# Altium project MotorDrive_1.PrjPcb
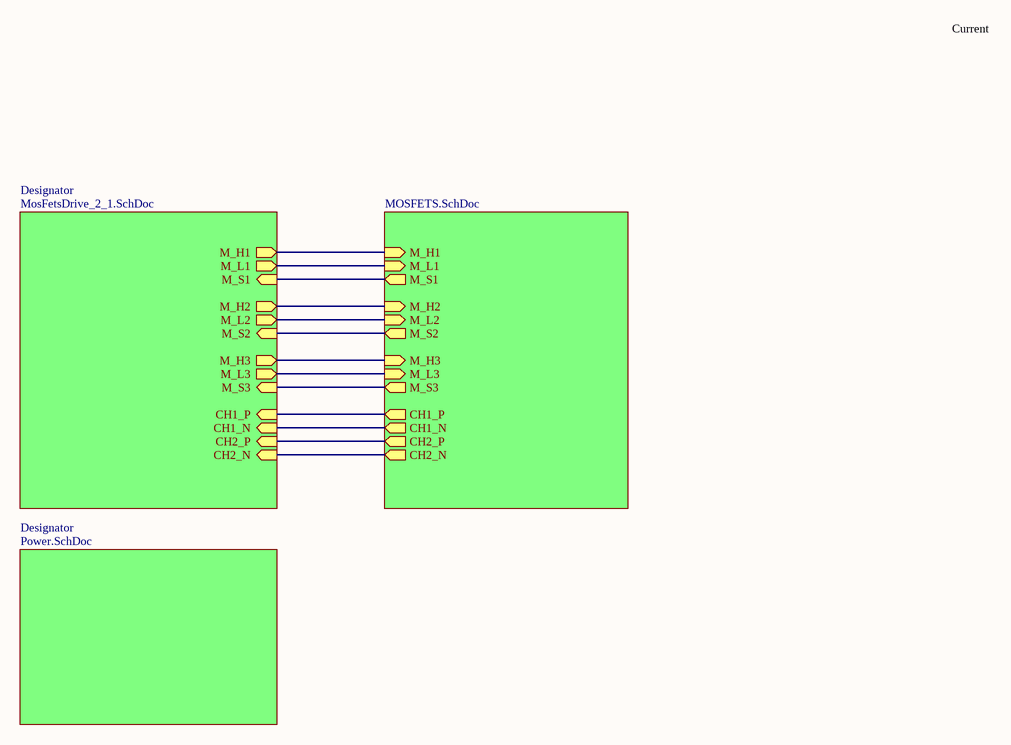
[diagram p0: MotorDriveBoard.SchDoc]
4 sheets, 68 parts. Net scope: hierarchical (ports join the sheet entries above them; power ports are global).
Board file: MotorDrive.PcbDoc
Sheets:
  MotorDriveBoard.SchDoc
     = MOSFETS.SchDoc
    Designator = MosFetsDrive_2_1.SchDoc
    Designator = Power.SchDoc

## Sheet MotorDriveBoard.SchDoc
size A4; SheetNumber: 2; SheetTotal: 7

### Sub-sheets
Designator = MosFetsDrive_2_1.SchDoc: M_H1 (out), M_L1 (out), M_H2 (out), M_L2 (out), M_H3 (out), M_L3 (out), M_S1 (in), M_S2 (in), M_S3 (in), CH1_P (in), CH1_N (in), CH2_P (in), CH2_N (in)
Designator = Power.SchDoc: no entries
? = MOSFETS.SchDoc: M_H1 (in), M_L1 (in), M_H2 (in), M_L2 (in), M_H3 (in), M_L3 (in), M_S1 (out), M_S2 (out), M_S3 (out), CH1_P (out), CH1_N (out), CH2_P (out), CH2_N (out)

### Nets
SH1_N: sheet /CH1_N, sheet Designator/CH1_N
SH1_P: sheet /CH1_P, sheet Designator/CH1_P
SH2_N: sheet /CH2_N, sheet Designator/CH2_N
SH2_P: sheet /CH2_P, sheet Designator/CH2_P
U: sheet /M_S1, sheet Designator/M_S1
V: sheet /M_S2, sheet Designator/M_S2
W: sheet /M_S3, sheet Designator/M_S3
NetR501_1: sheet /M_H1, sheet Designator/M_H1
NetR502_1: sheet /M_L1, sheet Designator/M_L1
NetR503_1: sheet /M_H2, sheet Designator/M_H2
NetR504_1: sheet /M_L2, sheet Designator/M_L2
NetR505_1: sheet /M_H3, sheet Designator/M_H3
NetR506_1: sheet /M_L3, sheet Designator/M_L3

### Notes on the sheet
- Current

## Sheet MOSFETS.SchDoc
size A4; SheetNumber: 3; SheetTotal: 7
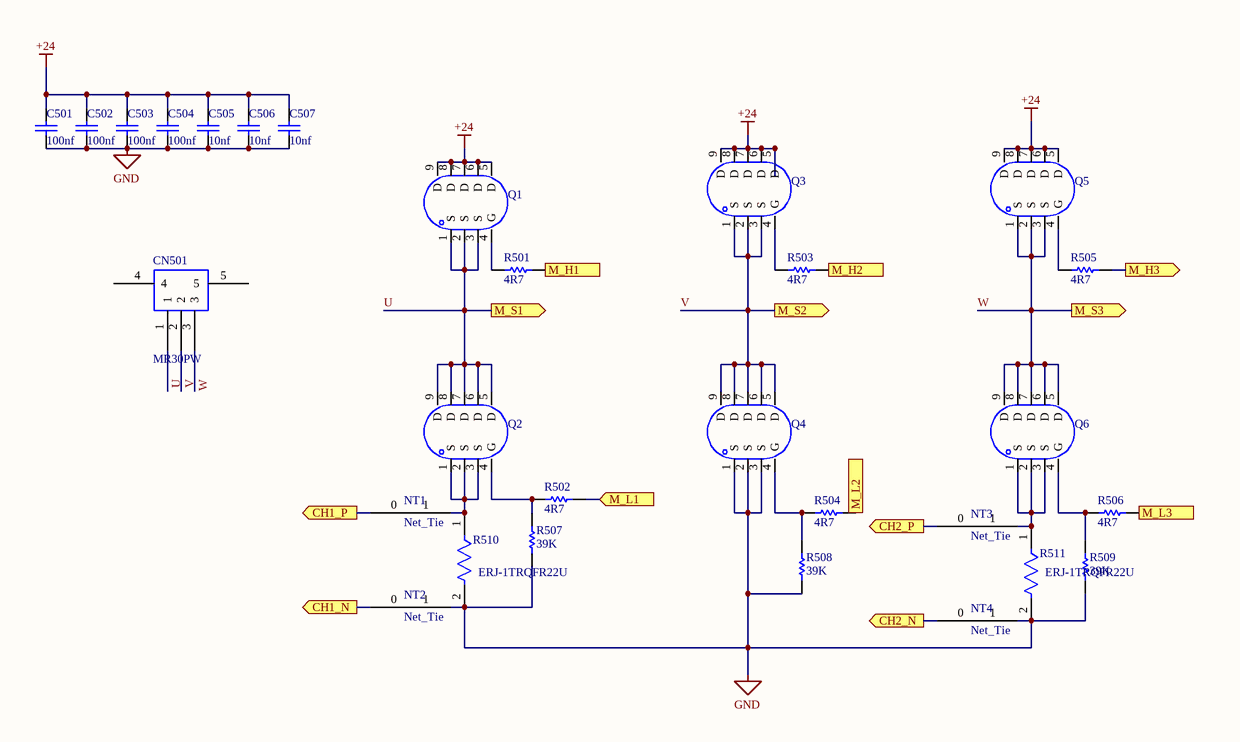
[diagram p1: MOSFETS.SchDoc]

### Parts
C501  100nf  [AVX-1206-2_L]
C502  100nf  [AVX-1206-2_L]
C503  100nf  [AVX-1206-2_L]
C504  100nf  [AVX-1206-2_L]
C505  10nf  [AVX-1206-2_L]
C506  10nf  [AVX-1206-2_L]
C507  10nf  [AVX-1206-2_L]
CN501  MR30PW  [MR30]
NT1  Net_Tie  [NT]  (net tie, no BOM)
NT2  Net_Tie  [NT]  (net tie, no BOM)
NT3  Net_Tie  [NT]  (net tie, no BOM)
NT4  Net_Tie  [NT]  (net tie, no BOM)
Q1  TPH1R403NL  [DSOP-8_L5.0-W5.0-P1.27-EP-TL]  (value not drawn)
Q2  TPH1R403NL  [DSOP-8_L5.0-W5.0-P1.27-EP-TL]  (value not drawn)
Q3  TPH1R403NL  [DSOP-8_L5.0-W5.0-P1.27-EP-TL]  (value not drawn)
Q4  TPH1R403NL  [DSOP-8_L5.0-W5.0-P1.27-EP-TL]  (value not drawn)
Q5  TPH1R403NL  [DSOP-8_L5.0-W5.0-P1.27-EP-TL]  (value not drawn)
Q6  TPH1R403NL  [DSOP-8_L5.0-W5.0-P1.27-EP-TL]  (value not drawn)
R501  4R7  [RESC1608X55X25ML10T15]
R502  4R7  [RESC1608X55X25ML10T15]
R503  4R7  [RESC1608X55X25ML10T15]
R504  4R7  [RESC1608X55X25ML10T15]
R505  4R7  [RESC1608X55X25ML10T15]
R506  4R7  [RESC1608X55X25ML10T15]
R507  39K  [RESC1608X55X25ML10T15]
R508  39K  [RESC1608X55X25ML10T15]
R509  39K  [RESC1608X55X25ML10T15]
R510  ERJ-1TRQFR22U  [FP-ERJ1TR-MFG]
R511  ERJ-1TRQFR22U  [FP-ERJ1TR-MFG]

### Ports
CH1_N (out), CH1_P (out), CH2_N (out), CH2_P (out), M_H1 (out), M_H2 (out), M_H3 (out), M_L1 (in), M_L2 (in), M_L3 (in), M_S1 (out), M_S2 (out), M_S3 (out)

### Nets
+24: C501.2 C502.2 C503.2 C504.2 C505.2 C506.2 C507.2 Q1.5(D) Q1.6(D) Q1.7(D) Q1.8(D) Q1.9(D) Q3.5(D) Q3.6(D) Q3.7(D) Q3.8(D) Q3.9(D) Q5.5(D) Q5.6(D) Q5.7(D) Q5.8(D) Q5.9(D)
GND: C501.1 C502.1 C503.1 C504.1 C505.1 C506.1 C507.1 NT2.1 NT4.1 Q4.1(S) Q4.2(S) Q4.3(S) R507.1 R508.1 R509.1 R510.2 R511.2
SH1_N: NT2.0 ; port CH1_N
SH1_P: NT1.0 ; port CH1_P
SH2_N: NT4.0 ; port CH2_N
SH2_P: NT3.0 ; port CH2_P
U: CN501.1 Q1.1(S) Q1.2(S) Q1.3(S) Q2.5(D) Q2.6(D) Q2.7(D) Q2.8(D) Q2.9(D) ; port M_S1
V: CN501.2 Q3.1(S) Q3.2(S) Q3.3(S) Q4.5(D) Q4.6(D) Q4.7(D) Q4.8(D) Q4.9(D) ; port M_S2
W: CN501.3 Q5.1(S) Q5.2(S) Q5.3(S) Q6.5(D) Q6.6(D) Q6.7(D) Q6.8(D) Q6.9(D) ; port M_S3
NetNT1_1: NT1.1 Q2.1(S) Q2.2(S) Q2.3(S) R510.1
NetNT3_1: NT3.1 Q6.1(S) Q6.2(S) Q6.3(S) R511.1
NetQ1_4: Q1.4(G) R501.2
NetQ2_4: Q2.4(G) R502.2 R507.2
NetQ3_4: Q3.4(G) R503.2
NetQ4_4: Q4.4(G) R504.2 R508.2
NetQ5_4: Q5.4(G) R505.2
NetQ6_4: Q6.4(G) R506.2 R509.2
NetR501_1: R501.1 ; port M_H1
NetR502_1: R502.1 ; port M_L1
NetR503_1: R503.1 ; port M_H2
NetR504_1: R504.1 ; port M_L2
NetR505_1: R505.1 ; port M_H3
NetR506_1: R506.1 ; port M_L3

Not connected (* = marked no-connect by the designer): CN501 4 5

### Library data of the parts
C501-C507 = CMP-2000-05468-1: Chip Capacitor, 1 nF, +/- 10%, -55 to 125 degC, 1206 (3216 Metric), RoHS, Tape and Reel; PartNumber: 1206GC102KAT1A; Manufacturer: AVX; Capacitance: 0.001uF; Dielectric: X7R; Voltage Rating DC: 2000V; Package Reference: 1206; Datasheet Version: 11/2010; Mounting Technology: SurfaceMount; Manufacturer URL: http://www.avx.com/; Tolerance: 10%; Tolerance (%): ±10%; Datasheet URL: https://datasheet.ciiva.com/11787/0900766b80ed4c37-11787781.pdf; Package Description: 2-Pin SMD, Body 3.4 x 1.8 mm; Case Size/Dimension: 1206; Rated Voltage: 2000V
CN501 = Component_1
Q1-Q6 = TPH1R403NL: Manufacturer: TOSHIBA(东芝); Add into BOM: yes; Type: N沟道; Drain Source Voltage (Vdss): 30V; Continuous Drain Current (Id): 150A; Power Dissipation (Pd): 64W; Drain Source On Resistance (RDS(on)@Vgs,Id): 1.4mΩ@10V,30A; Gate Threshold Voltage (Vgs(th)@Id): 2.3V@500A; Symbol: TPH1R403NL; Device: TPH1R403NL; LCSC Part Name: N沟道 30V 150A; Supplier Part: C83440; Manufacturer Part: TPH1R403NL; Supplier Footprint: SOP Advance; JLCPCB Part Class: Extended Part; Datasheet: https://atta.szlcsc.com/upload/public/pdf/source/20170908/C83440_1504870121708958077.pdf; Supplier: LCSC; Convert to PCB: yes
R501-R509 = CMP-2100-03667-1: Chip Resistor, 0 Ohm, +/- 5%, 0.1 W, -55 to 155 degC, 0603 (1608 Metric), RoHS, Tape and Reel; Manufacturer: Yageo; Temperature Coefficient: 200ppm/degreesC; Voltage Rating: 50V; Power Rating: 100mW; Resistance: 0mOhm; Width: 0.8mm; Max Operating Temperature: 155degC; Tolerance: 5%; Package Reference: 0603; Height: 0.45mm; Depth: 0.8mm; Package Description: 2-Pin Surface Mount Device, Body 1.6 x 0.8 mm; Termination: SMD/SMT; Package Quantity: 5000; Case/Package: 0603; Case Code (Imperial): 0603; Radiation Hardening: No; Number of Pins: 2; Length: 1.6mm; Lead Free: LeadFree; Voltage Rating (DC): 50V; Military Standard: Not; Datasheet URL: http://www.yageo.com/NewPortal/yageodocoutput?fileName=/pdf/R-Chip/PYu-RC_Group_51_RoHS_L_5.pdf; Manufacturer URL: http://www.yageo.com/; Packaging: TapeandReel; Case Code (Metric): 1608; Min Operating Temperature: -55degC; Composition: ThickFilm; RoHSCompliant: true; Contact Plating: Tin; Datasheet Version: Rev. 5, 10/2016; REACH SVHC: NoSVHC
R510 R511 = CMP-05422-000060-1: RES 0.22 OHM 1% 1W 2512; Manufacturer: Panasonic; 3DS Part Number: 110-00006; Value: 0.22Ω; Automotive Grade: Grade 0; Temperature Coefficient: 200ppm/°C; Digikey Description: RES 0.22 OHM 1% 1W 2512; Tolerance: 1%; Temperature Range High: +155°C; Temperature Range Low: -55°C; Series: ERJ; Category: Res; Power Rating: 1W; ComponentLink2URL: https://industrial.panasonic.com/cdbs/www-data/pdf/RDN0000/AOA0000C313.pdf; Device Class L1: Passive Components; Octopart: https://octopart.com/erj1trqfr22u-panasonic-10566390; Device Class L3: Chip SMD Resistors; Temperature: -55°C to +155°C; Composition: Thick Film; Device Class L2: Resistors; Footprint Url: https://industrial.panasonic.com/cdbs/www-data/pdf/RDN0000/DMN0000COL17.pdf; Ipc Land Pattern Name: RESC640320X60; Package: ERJ1TR; Resistance: 0.22Ω; Mouser Description: Current Sense Resistors 2512 0.22ohm 1% Curr Sense AEC-Q200; Manufacturer Part Number: ERJ-1TRQFR22U; RoHS: TRUE; ComponentLink2Description: Datasheet; Lead Free: Yes; Height: 0.7mm; Automotive: Yes

## Sheet MosFetsDrive_2_1.SchDoc
size A4; SheetNumber: 1; SheetTotal: 7
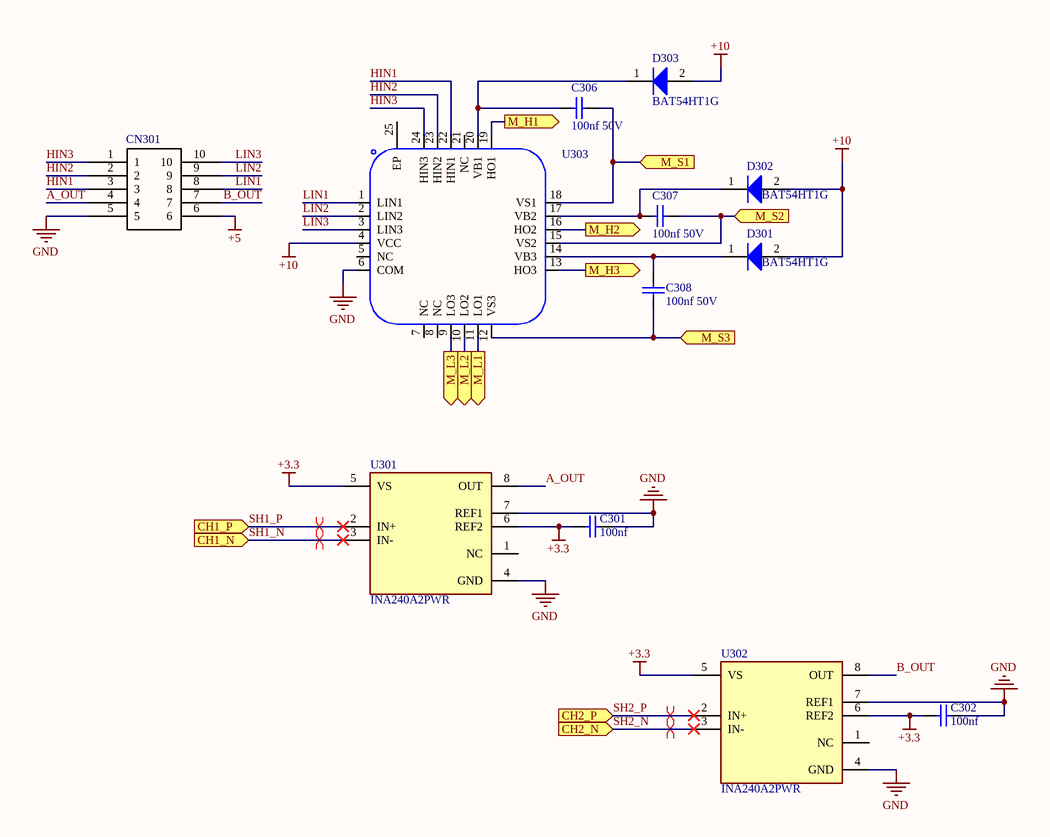
[diagram p2: MosFetsDrive_2_1.SchDoc]

### Parts
C301  100nf  [CAPC1608X90X35ML10T15]
C302  100nf  [CAPC1608X90X35ML10T15]
C306  100nf 50V  [CAPC1005X60X30ML05T10]
C307  100nf 50V  [CAPC1005X60X30ML05T10]
C308  100nf 50V  [CAPC1005X60X30ML05T10]
CN301  (no value)  [2X10Pin]
D301  BAT54HT1G  [ONSC-SOD-323-2-477-02_V]
D302  BAT54HT1G  [ONSC-SOD-323-2-477-02_V]
D303  BAT54HT1G  [ONSC-SOD-323-2-477-02_V]
U301  INA240A2PWR  [FP-PW0008A-MFG]
U302  INA240A2PWR  [FP-PW0008A-MFG]
U303  FD6288Q  [QFN-24_L4.0-W4.0-P0.50-BL-EP2.6]  (value not drawn)

### Ports
CH1_N (in), CH1_P (in), CH2_N (in), CH2_P (in), M_H1 (out), M_H2 (out), M_H3 (out), M_L1 (out), M_L2 (out), M_L3 (out), M_S1 (in), M_S2 (in), M_S3 (in)

### Nets
+3.3: C301.2 C302.2 U301.5(VS) U301.6(REF2) U302.5(VS) U302.6(REF2)
+5: CN301.6
+10: D301.2(A) D302.2(A) D303.2(A) U303.4(VCC)
GND: C301.1 C302.1 CN301.5 U301.4(GND) U301.7(REF1) U302.4(GND) U302.7(REF1) U303.6(COM)
A_OUT: CN301.4 U301.8(OUT)
B_OUT: CN301.7 U302.8(OUT)
HIN1: CN301.3 U303.22(HIN1)
HIN2: CN301.2 U303.23(HIN2)
HIN3: CN301.1 U303.24(HIN3)
LIN1: CN301.8 U303.1(LIN1)
LIN2: CN301.9 U303.2(LIN2)
LIN3: CN301.10 U303.3(LIN3)
SH1_N: U301.3(IN-) ; port CH1_N
SH1_P: U301.2(IN+) ; port CH1_P
SH2_N: U302.3(IN-) ; port CH2_N
SH2_P: U302.2(IN+) ; port CH2_P
U: C306.2 U303.18(VS1) ; port M_S1
V: C307.2 U303.15(VS2) ; port M_S2
W: C308.1 U303.12(VS3) ; port M_S3
NetC306_1: C306.1 D303.1(K) U303.20(VB1)
NetC307_1: C307.1 D302.1(K) U303.17(VB2)
NetC308_2: C308.2 D301.1(K) U303.14(VB3)
NetR501_1: U303.19(HO1) ; port M_H1
NetR502_1: U303.11(LO1) ; port M_L1
NetR503_1: U303.16(HO2) ; port M_H2
NetR504_1: U303.10(LO2) ; port M_L2
NetR505_1: U303.13(HO3) ; port M_H3
NetR506_1: U303.9(LO3) ; port M_L3

Not connected (* = marked no-connect by the designer): U301 1(NC); U302 1(NC); U303 5(NC) 7(NC) 8(NC) 21(NC) 25(EP)

### Layout directives
differential pair: SH1_N, SH1_P, SH2_N, SH2_P

### Library data of the parts
C301 C302 = CMP-2100-03642-1: Chip Capacitor, 10 nF, +/- 10%, 50 V, -55 to 125 degC, 0603 (1608 Metric), RoHS, Tape and Reel; Manufacturer: Murata; Insulation Resistance: 10GR; Dielectric: X7R; Voltage Rating: 50V; Capacitance: 10nF; Material: Ceramic; Package Quantity: 1; Lead Free: LeadFree; Case/Package: 0603; Termination: SMD/SMT; REACH SVHC: Unknown; Manufacturer URL: http://www.murata.com/; Datasheet URL: http://search.murata.co.jp/Ceramy/image/img/A01X/G101/ENG/GRM188R71H103KA01-01.pdf; Mount: SurfaceMount; Datasheet Version: 42401.0; Number of Pins: 2; Length: 1.6mm; Voltage: 50V; Depth: 0.8mm; Tolerance: 10%; Min Operating Temperature: -55degC; Voltage Rating (DC): 50V; Max Operating Temperature: 125degC; Package Description: 2-Pin Surface Mount Device, Body 1.6 x 0.8 mm; RoHSCompliant: True; Case Code (Imperial): 0603; Width: 0.031inch; Case Code (Metric): 1608; Height: 0.8mm; Package Reference: 0603; Packaging: TapeandReel; Thickness: 0.035inch; Dielectric Material: Ceramic
C306-C308 = CMP-2008-02046-1: Manufacturer: Kemet; Part Number: C0402C104K8PACTU
CN301 = Component_1
D301-D303 = CMP-1055-00462-1: Schottky Barrier Diode, 2-Pin SOD-323, Pb-Free, Tape and Reel; Manufacturer: On Semiconductor; Configuration: Single; trr Max (ns): 5; IFSM Max (A): 0.6; ComponentLink3URL: http://www.onsemi.com/pub_link/Collateral/477-02.PDF.1; PackageDescription: 2-Pin SOD, Body 1.7 x 1.25 mm; ComponentLink2URL: http://www.onsemi.cn/pub_link/Collateral/BAT54HT1-D.PDF; ComponentLink3Description: Package Specification; ComponentLink2Description: Datasheet; DatasheetVersion: Rev. 6; PackageReference: SOD-323-2-477-02; RoHS: TRUE; ComponentLink1URL: http://www.onsemi.com/; Packing: Tape and Reel; PartNumber: BAT54HT1G; Mounting Technology: Surface Mount; ComponentLink1Description: Manufacturer URL; PackageVersion: Rev. H, 03/2007
U301 U302 = CMP-04895-000047-1: IC AMP CURRENT SENSE 8-TSSOP; Manufacturer: Texas Instruments; Voltage Gain: 0.05V/mV; Max Supply Voltage: 5.5V; Max Junction Temp: +150°C; Input Offset Voltage: 0.005mV; Bandwidth: 400kHz; Min Supply Voltage: 2.7V; Nominal Supply Current: 1.8mA; Standoff Height: 0.05mm; Number Of Channels: 1; Input Bias Current: 90uA; ComponentLink2URL: http://www.ti.com/lit/ds/symlink/ina240.pdf; Device Class L2: Linear ICs; ComponentLink2Description: Datasheet; Temperature: -40°C to +125°C; Octopart: https://octopart.com/ina240a2pwr-texas+instruments-75431049; Automotive: No; Manufacturer Part Number: INA240A2PWR; Ambient Temperature Range Low: -40°C; RoHS: TRUE; Package: PW0008A; Device Class L1: Integrated Circuits (ICs); Temperature Range Low: -40°C; Category: IC; Ipc Land Pattern Name: SOP65P300X120-8; Temperature Range High: +125°C; Ambient Temperature Range High: +125°C; Height: 1.2mm; Lead Free: Yes; Device Class L3: Instrumentation; Digikey Description: IC AMP CURRENT SENSE 8-TSSOP
U303 = FD6288Q: Manufacturer: Fortior Tech(峰岹); Symbol: FD6288Q_C328453; Add into BOM: yes; Device: FD6288Q; LCSC Part Name: FD6288Q; Supplier Part: C328453; Manufacturer Part: FD6288Q; Supplier Footprint: QFN-24; JLCPCB Part Class: Extended Part; Datasheet: https://atta.szlcsc.com/upload/public/pdf/source/20181108/C328453_785547738DB9FC0123219FC22539EFAD.pdf; Supplier: LCSC; Convert to PCB: yes

## Sheet Power.SchDoc
size A4; SheetNumber: 5; SheetTotal: 7
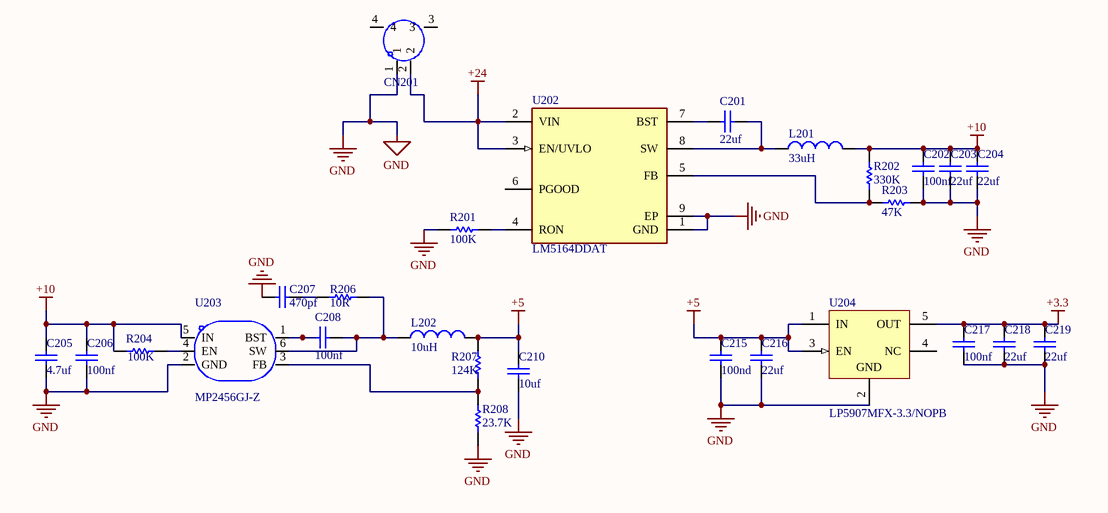
[diagram p3: Power.SchDoc]

### Parts
C201  22uf  [CAPC1608X90X35NL10T15]
C202  100nf  [CAPC0805(2012)145_N]
C203  22uf  [CAPC0805(2012)145_N]
C204  22uf  [CAPC0805(2012)145_N]
C205  4.7uf  [CAPC1608X87X35ML15T15]
C206  100nf  [CAPC1608X87X35ML15T15]
C207  470pf  [CAPC1608X87X35ML15T15]
C208  100nf  [CAPC1608X87X35ML15T15]
C210  10uf  [CAPC1608X87X35ML15T15]
C215  100nd  [CAPC1608X87X35ML15T15]
C216  22uf  [CAPC1608X87X35ML15T15]
C217  100nf  [CAPC1608X87X35ML15T15]
C218  22uf  [CAPC1608X87X35ML15T15]
C219  22uf  [CAPC1608X87X35ML15T15]
CN201  XT30PW-M  [CONN-TH_XT30PW-M]  (value not drawn)
L201  33uH  [TAYO-IND0315_V]
L202  10uH  [TAYO-IND0315_V]
R201  100K  [RESC1608X55X25ML10T15]
R202  330K  [RESC2013X50X30LL20T20]
R203  47K  [RESC2013X50X30LL20T20]
R204  100K  [RESC1608X55X25ML10T15]
R206  10R  [RESC1608X55X25ML10T15]
R207  124K  [RESC1608X55X25ML10T15]
R208  23.7K  [RESC1608X55X25ML10T15]
U202  LM5164DDAT  [FP-DDA0008E-MFG]
U203  MP2456GJ-Z  [TSOT-23-6_L2.9-W1.6-P0.95-LS2.8-BR]
U204  LP5907MFX-3.3/NOPB  [DBV0005A_L]

### Nets
+3.3: C217.2 C218.2 C219.2 U204.5(OUT)
+5: C210.2 C215.2 C216.2 L202.2 R207.1 U204.1(IN) U204.3(EN)
+10: C202.2 C203.2 C204.2 C205.2 C206.2 L201.2 R202.2 R204.1 U203.5(IN)
+24: CN201.2 U202.2(VIN) U202.3(EN/UVLO)
GND: C202.1 C203.1 C204.1 C205.1 C206.1 C207.2 C210.1 C215.1 C216.1 C217.1 C218.1 C219.1 CN201.1 R201.1 R203.2 R208.1 U202.1(GND) U202.9(EP) U203.2(GND) U204.2(GND)
NetC201_1: C201.1 U202.7(BST)
NetC201_2: C201.2 L201.1 U202.8(SW)
NetC207_1: C207.1 R206.1
NetC208_1: C208.1 L202.1 R206.2 U203.6(SW)
NetC208_2: C208.2 U203.1(BST)
NetR201_2: R201.2 U202.4(RON)
NetR202_1: R202.1 R203.1 U202.5(FB)
NetR204_2: R204.2 U203.4(EN)
NetR207_2: R207.2 R208.2 U203.3(FB)

Not connected (* = marked no-connect by the designer): CN201 3 4; U202 6(PGOOD); U204 4(NC)

### Library data of the parts
C201 = CMP-2006-02792-1: Part Number: GRM188R60J106ME47D; Manufacturer: Murata
C202-C204 = CMP-1036-04552-1: CAP 220nF 50V ±10% 0805 (2012 Metric) Thickness 1.45mm SMD; Tolerance: Â±10%; Case-Metric: 2012; Case-EIA: 0805; Value: 220nF; Max Thickness: 1.45 mm; Technology: SMT; Rated Voltage: 50 V
C205-C208 C210 C215-C219 = CMP-2006-03046-1: Manufacturer: Kemet; Part Number: C0603C103K5RAC7867
CN201 = XT30PW-M: Manufacturer: AMASS(艾迈斯); Add into BOM: yes; Symbol: XT30PW-M; Device: XT30PW-M; LCSC Part Name: XT30PW-M公头; Supplier Part: C431092; Manufacturer Part: XT30PW-M; Supplier Footprint: Through Hole; JLCPCB Part Class: Extended Part; Datasheet: https://atta.szlcsc.com/upload/public/pdf/source/20220222/6A9F22F7850E25B33E1BE430ADF8560B.pdf; Supplier: LCSC; Convert to PCB: yes
L201 L202 = CMP-0569-00001-2: SMD Power Inductor, 2.2 uH, +/- 20%, 3 x 3 x 1.5 mm, -25 to 120 degC, Pb-Free, Tape and Reel; Manufacturer: Taiyo Yuden; PartNumber: NR3015T2R2M; Inductance: 2.2 uH (+/-20%); Rated Current-Temperature Rise Current: 1500 mA; DC Resistance (max): 0.072 Ohm; Rated Current-Saturation Current: 1480 mA; Inductance Measuring Frequency: 100 kHz; Self-Resonant Frequency (min): 64 MHz; Avg. of DC. Resistance: 0.06 Ohm; Soldering Method: Reflow; Temperature Range: -25 to 120 degC; ComponentLink1Description: Manufacturer URL; Mounting Technology: Surface Mount; Halogen Free: TRUE; ComponentLink1URL: www.yuden.co.jp; Packing: Tape and Reel; DatasheetVersion: 1/11/2013; PackageDescription: 2-Pin SMT Inductor, Body 3 x 3 mm; ComponentLink2URL: http://www.yuden.co.jp/ut/product/category/inductor/NR3015T2R2M.pdf; RoHS Compliance: TRUE; PackageReference: IND3015; ComponentLink2Description: Datasheet; Case Size: 3015
R201 R204 R206-R208 = CMP-2100-03667-1: as R501 on sheet MOSFETS; Width: 0.8mm; Max Operating Temperature: 155degC; Tolerance: 5%; Package Reference: 0603; Height: 0.45mm; Depth: 0.8mm; Package Description: 2-Pin Surface Mount Device, Body 1.6 x 0.8 mm; Termination: SMD/SMT; Package Quantity: 5000; Case/Package: 0603; Case Code (Imperial): 0603; Radiation Hardening: No; Number of Pins: 2; Length: 1.6mm; Lead Free: LeadFree; Voltage Rating (DC): 50V; Military Standard: Not; Datasheet URL: http://www.yageo.com/NewPortal/yageodocoutput?fileName=/pdf/R-Chip/PYu-RC_Group_51_RoHS_L_5.pdf; Manufacturer URL: http://www.yageo.com/; Packaging: TapeandReel; Case Code (Metric): 1608; Min Operating Temperature: -55degC; Composition: ThickFilm; RoHSCompliant: true; Contact Plating: Tin; Datasheet Version: Rev. 5, 10/2016; REACH SVHC: NoSVHC
R202 R203 = CMP-2001-04896-1: Manufacturer: Vishay Dale; Part Number: CRCW08050000Z0EA
U202 = CMP-04918-000052-1: IC REG BUCK ADJUSTABLE 1A 8SOPWR; Manufacturer: Texas Instruments; Nominal Supply Current: 600uA; Switching Frequency: 1000kHz; Number Of Outputs: 1; Min Supply Voltage: 6V; Max Junction Temp: +150°C; Max Duty Cycle: 100%; Output Voltage: 1.2-90V; Output Type: AdjustableProgrammable; Max Supply Voltage: 100V; Standoff Height: 0mm; Device Class L1: Integrated Circuits (ICs); Temperature Range High: +150°C; Lead Free: Yes; Temperature: -40°C to +150°C; Category: IC; Device Class L2: Power Management ICs; Digikey Description: IC REG BUCK ADJUSTABLE 1A 8SOPWR; Mouser Description: 6-V to 100-V input, 1-A synchronous buck DC-DC converter with ultra-low IQ 8-SO PowerPAD -40 to 150; Temperature Range Low: -40°C; Octopart: https://octopart.com/lm5164ddat-texas+instruments-96785745; ComponentLink2Description: Datasheet; Manufacturer Part Number: LM5164DDAT; Device Class L3: Voltage Regulators - Switching; Package: DDA0008E; RoHS: TRUE; Ipc Land Pattern Name: SOIC127P600X170-8; Output Current: 1A; Automotive: No; ComponentLink2URL: http://www.ti.com/lit/ds/symlink/lm5164.pdf; Height: 1.7mm; Switching Topology: Buck
U203 = MP2456GJ-Z: Add into BOM: yes; Symbol: MP2456GJ-Z; Device: MP2456GJ-Z; LCSC Part Name: MP2456GJ-Z; Supplier Part: C88045; Manufacturer Part: MP2456GJ-Z; Supplier Footprint: TSOT-23-6; JLCPCB Part Class: Extended Part; Supplier: LCSC; Convert to PCB: yes; Output Type: -; Number of Outputs: -; Voltage - Input (Min): -; Voltage - Input (Max): -; Voltage - Output (Min/Fixed): -; Voltage - Output (Max): -; Current - Output: -; Frequency - Switching: -; Function: -; Synchronous Rectifier: -; Output Configuration: -; Topology: -
U204 = CMP-2000-07464-1: Ultra-Low-Noise, Low-IQ LDO, 0.25 A, Fixed 3.3 V Output, 2.2 to 5.5 V Input, -40 to 125 degC, 5-Pin SOT-23 (DBV), Green (RoHS & no Sb/Br), Tape and Reel; Manufacturer: Texas Instruments; Max Output Current: 250mA; Max Input Voltage: 5.5V; Dropout Voltage: 250mV; Number of Regulators: 1; Nominal Output Voltage: 3.3V; Output Voltage Accuracy: 2%; Polarity: Positive; Min Input Voltage: 2.2V; Package Version: 4073253-4/N, 12/2014; Quiescent Current: 425uA; Power Supply Rejection Ratio (PSRR): 82dB; Case\/Package: SOT-23; Lead Free: LeadFree; Package Reference: DBV5; Output Current: 250mA; Package Description: 5-Pin Small Outline Transistor, Body 2.9 x 1.6 mm, Pitch 0.95 mm; Max Operating Temperature: 125degC; Mounting Technology: SurfaceMount; Number of Pins: 5; Mount: SurfaceMount; Manufacturer URL: http://www.ti.com/; Accuracy: 2%; Package URL: http://www.ti.com/lit/ml/mpds018l/mpds018l.pdf; Output Voltage: 3.3V; Radiation Hardening: No; Number of Outputs: 1; Packaging: TapeandReel; RoHSCompliant: true; Min Operating Temperature: -40degC; Datasheet URL: http://www.ti.com/lit/ds/symlink/lp5907.pdf; Package Quantity: 3000; Datasheet Version: Rev. L, 09/2016; REACH SVHC: NoSVHC; Contact Plating: Tin

## Nets that join several sheets
+3.3: MosFetsDrive_2_1 (6 pins), Power (C217.2 C218.2 C219.2 U204.5)
+5: MosFetsDrive_2_1 (CN301.6), Power (7 pins)
+10: MosFetsDrive_2_1 (D301.2 D302.2 D303.2 U303.4), Power (9 pins)
+24: MOSFETS (22 pins), Power (CN201.2 U202.2 U202.3)
GND: MOSFETS (17 pins), MosFetsDrive_2_1 (8 pins), Power (20 pins)
NetR501_1: MOSFETS (R501.1), MosFetsDrive_2_1 (U303.19)
NetR502_1: MOSFETS (R502.1), MosFetsDrive_2_1 (U303.11)
NetR503_1: MOSFETS (R503.1), MosFetsDrive_2_1 (U303.16)
NetR504_1: MOSFETS (R504.1), MosFetsDrive_2_1 (U303.10)
NetR505_1: MOSFETS (R505.1), MosFetsDrive_2_1 (U303.13)
NetR506_1: MOSFETS (R506.1), MosFetsDrive_2_1 (U303.9)
SH1_N: MOSFETS (NT2.0), MosFetsDrive_2_1 (U301.3)
SH1_P: MOSFETS (NT1.0), MosFetsDrive_2_1 (U301.2)
SH2_N: MOSFETS (NT4.0), MosFetsDrive_2_1 (U302.3)
SH2_P: MOSFETS (NT3.0), MosFetsDrive_2_1 (U302.2)
U: MOSFETS (9 pins), MosFetsDrive_2_1 (C306.2 U303.18)
V: MOSFETS (9 pins), MosFetsDrive_2_1 (C307.2 U303.15)
W: MOSFETS (9 pins), MosFetsDrive_2_1 (C308.1 U303.12)